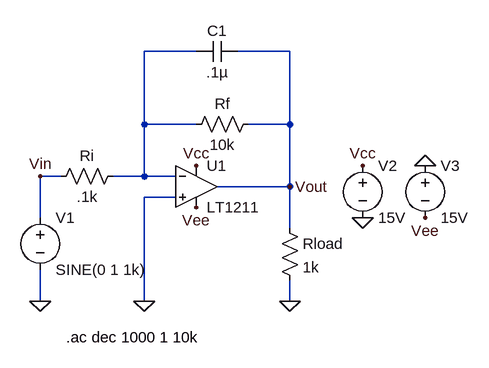
[diagram p0: schematic Ac analysis.asc]
Ac analysis.asc, the LTspice schematic file:
Version 4
SHEET 1 952 680
WIRE 528 80 448 80
WIRE 672 80 592 80
WIRE 448 192 448 80
WIRE 528 192 448 192
WIRE 672 192 672 80
WIRE 672 192 608 192
WIRE 320 272 288 272
WIRE 448 272 448 192
WIRE 448 272 400 272
WIRE 496 272 448 272
WIRE 672 288 672 192
WIRE 672 288 560 288
WIRE 496 304 448 304
WIRE 288 336 288 272
WIRE 672 352 672 288
WIRE 288 464 288 416
WIRE 448 464 448 304
WIRE 672 464 672 432
FLAG 288 464 0
FLAG 448 464 0
FLAG 672 464 0
FLAG 784 256 Vcc
FLAG 528 256 Vcc
FLAG 528 320 Vee
FLAG 288 272 Vin
FLAG 672 288 Vout
FLAG 784 336 0
FLAG 880 336 Vee
FLAG 880 256 0
SYMBOL OpAmps/LT1211 528 224 R0
SYMATTR InstName U1
SYMBOL res 656 336 R0
SYMATTR InstName Rload
SYMATTR Value 1k
SYMBOL res 624 176 R90
WINDOW 0 0 56 VBottom 2
WINDOW 3 32 56 VTop 2
SYMATTR InstName Rf
SYMATTR Value 10k
SYMBOL res 416 256 R90
WINDOW 0 0 56 VBottom 2
WINDOW 3 32 56 VTop 2
SYMATTR InstName Ri
SYMATTR Value .1k
SYMBOL voltage 288 320 R0
SYMATTR InstName V1
SYMATTR Value SINE(0 1 1k)
SYMATTR Value2 AC 1
SYMBOL voltage 784 240 R0
SYMATTR InstName V2
SYMATTR Value 15V
SYMBOL voltage 880 240 R0
SYMATTR InstName V3
SYMATTR Value 15V
SYMBOL cap 592 64 R90
WINDOW 0 0 32 VBottom 2
WINDOW 3 32 32 VTop 2
SYMATTR InstName C1
SYMATTR Value .1µ
TEXT 328 520 Left 2 !.ac dec 1000 1 10k

The netlist it stands for:
* Ac analysis.asc
XU1 0 N001 Vcc Vee Vout LT1211  ; pins In+ In- V+ V- OUT
Rload Vout 0 1k
Rf Vout N001 10k
Ri N001 Vin .1k
V1 Vin 0 SINE(0 1 1k) AC 1
V2 Vcc 0 15V
V3 0 Vee 15V
C1 Vout N001 .1µ
.ac dec 1000 1 10k
.lib LTC.lib
.backanno
.end